# EAGLE design USB-UART_FT230XS_double-sided (EAGLE 7.4.0)
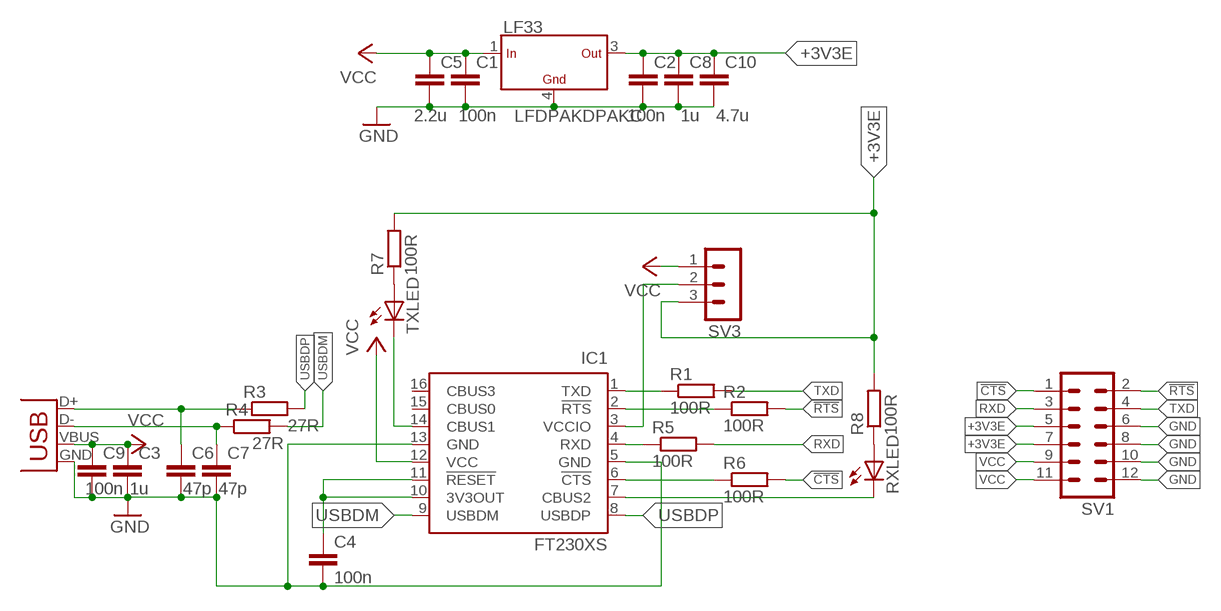
[diagram p0: schematic, sheet 1]

## Parts
C1  100n  C-EUC0805  [C0805]
C2  100n  C-EUC0805  [C0805]
C3  1u  C-EUC0805  [C0805]
C4  100n  C-EUC0805  [C0805]
C5  2.2u  C-EUC1206  [C1206]
C6  47p  C-EUC0805  [C0805]
C7  47p  C-EUC0805  [C0805]
C8  1u  C-EUC1206  [C1206]
C9  100n  C-EUC1206  [C1206]
C10  4.7u  C-EUC1206  [C1206]
IC1  FT230XS  [SSOP16]
LF33  LFDPAKDPAKC  [DPAK]
R1  100R  R-EU_M0805  [M0805]
R2  100R  R-EU_M0805  [M0805]
R3  27R  R-EU_M0805  [M0805]
R4  27R  R-EU_M0805  [M0805]
R5  100R  R-EU_M0805  [M0805]
R6  100R  R-EU_M0805  [M0805]
R7  100R  R-EU_M0805  [M0805]
R8  100R  R-EU_M0805  [M0805]
RXLED  LEDCHIP-LED0603  [CHIP-LED0603]
SV1  MA06-2  [MA06-2]
SV3  MA03-1  [MA03-1]
TXLED  LEDCHIP-LED0603  [CHIP-LED0603]
X1  USBSMD  [USB-MINIB]

## Nets
!CTS: R6.2 SV1.1
!RTS: R2.2 SV1.2
+3V3E: C2.1 C8.1 C10.1 LF33.3(OUT) R7.2 R8.2 SV1.5 SV1.7 SV3.3
GND: C1.2 C2.2 C3.2 C4.2 C5.2 C6.2 C7.2 C8.2 C9.2 C10.2 IC1.5(GND) IC1.13(GND) LF33.4(GND) SV1.6 SV1.8 SV1.10 SV1.12 X1.GND
N$1: C6.1 R3.1 X1.D+
N$2: C7.1 R4.1 X1.D-
N$3: IC1.1(TXD) R1.1
N$4: IC1.2(!RTS) R2.1
N$5: IC1.4(RXD) R5.1
N$6: R7.1 TXLED.A
N$7: IC1.3(VCCIO) SV3.2
N$8: R8.1 RXLED.A
N$9: IC1.14(CBUS1) TXLED.C
N$11: IC1.6(!CTS) R6.1
N$12: C4.1 IC1.10(3V3OUT) IC1.11(!RESET)
RXD: R5.2 SV1.3
RXLED: IC1.7(CBUS2) RXLED.C
TXD: R1.2 SV1.4
USBDM: IC1.9(USBDM) R4.2
USBDP: IC1.8(USBDP) R3.2
VCC: C1.1 C3.1 C5.1 C9.1 IC1.12(VCC) LF33.1(IN) SV1.9 SV1.11 SV3.1 X1.VBUS
Unconnected: IC1.15(CBUS0) IC1.16(CBUS3)

## Library data of the parts
C1-C10 = rcl:C-EU: CAPACITOR, European symbol
IC1 = ftdichip:FT230X: USB to BASIC UART IC Auto generated by make-symbol-device-package-bsdl.ulp Rev. 43 Source: Data sheet <http://www.ftdichip.com/Support/Documents/DataSheets/ICs/DS_FT230X.pdf>
LF33 = #PaJa_30:LF??C: LF??C - stabilizátory low-drop výstup dle typu 1,25 - 12V
R1-R8 = rcl:R-EU_: RESISTOR, European symbol
RXLED TXLED = led:LED: LED OSRAM: - CHIPLED LG R971, LG N971, LY N971, LG Q971, LY Q971, LO R971, LY R971 LH N974, LH R974 LS Q976, LO Q976, LY Q976 LO Q996 - Hyper CHIPLED LW Q18S LB Q993, LB Q99A, LB R99A - SideLED LS A670, LO A670, LY A670, LG A670, LP A670 LB A673, LV A673, LT A673, LW A673 LH A674 LY A675 LS A676, LA A676, LO A676, LY A676, LW A676 LS A679, LY A679, LG A679 - Hyper Micro SIDELED® LS Y876, LA Y876, LO Y876, LY Y876 LT Y87S - SmartLED LW L88C, LW L88S LB L89C, LB L89S, LG L890 LS L89K, LO L89K, LY L89K LS L896, LA L896, LO L896, LY L896 - TOPLED LS T670, LO T670, LY T670, LG T670, LP T670 LSG T670, LSP T670, LSY T670, LOP T670, LYG T670 LG T671, LOG T671, LSG T671 LB T673, LV T673, LT T673, LW T673 LH T674 LS T676, LA T676, LO T676, LY T676, LB T676, LH T676, LSB T676, LW T676 LB T67C, LV T67C, LT T67C, LS T67K, LO T67K, LY T67K, LW E67C LS E67B, LA E67B, LO E67B, LY E67B, LB E67C, LV E67C, LT E67C LW T67C LS T679, LY T679, LG T679 LS T770, LO T770, LY T770, LG T770, LP T770 LB T773, LV T773, LT T773, LW T773 LH T774 LS E675, LA E675, LY E675, LS T675 LS T776, LA T776, LO T776, LY T776, LB T776 LHGB T686 LT T68C, LB T68C - Hyper Mini TOPLED® LB M676 - Mini TOPLED Santana® LG M470 LS M47K, LO M47K, LY M47K Source: http://www.osram.convergy.de LUXEON: - LUMILED® LXK2-PW12-R00, LXK2-PW12-S00, LXK2-PW14-U00, LXK2-PW14-V00 LXK2-PM12-R00, LXK2-PM12-S00, LXK2-PM14-U00 LXK2-PE12-Q00, LXK2-PE12-R00, LXK2-PE12-S00, LXK2-PE14-T00, LXK2-PE14-U00 LXK2-PB12-K00, LXK2-PB12-L00, LXK2-PB12-M00, LXK2-PB14-N00, LXK2-PB14-P00, LXK2-PB14-Q00 LXK2-PR12-L00, LXK2-PR12-M00, LXK2-PR14-Q00, LXK2-PR14-R00 LXK2-PD12-Q00, LXK2-PD12-R00, LXK2-PD12-S00 LXK2-PH12-R00, LXK2-PH12-S00 LXK2-PL12-P00, LXK2-PL12-Q00, LXK2-PL12-R00 Source: www.luxeon.com KINGBRIGHT: KA-3528ASYC Source: www.kingbright.com
SV1 = con-lstb:MA06-2: PIN HEADER; OC_FARNELL: unknown; OC_NEWARK: unknown
SV3 = con-lstb:MA03-1: PIN HEADER; OC_FARNELL: unknown; OC_NEWARK: unknown
X1 = SparkFun:USB: USB Connectors USB-B-PTH is fully proven SKU : PRT-00139 USB-miniB is fully proven SKU : PRT-00587 USB-A-PCB is untested. USB-A-H is throughly reviewed, but untested. Spark Fun Electronics SKU : PRT-00437 USB-B-SMT is throughly reviewed, but untested. Needs silkscreen touching up. USB-A-S has not been used/tested USB-MB-H has not been used/tested

## Board
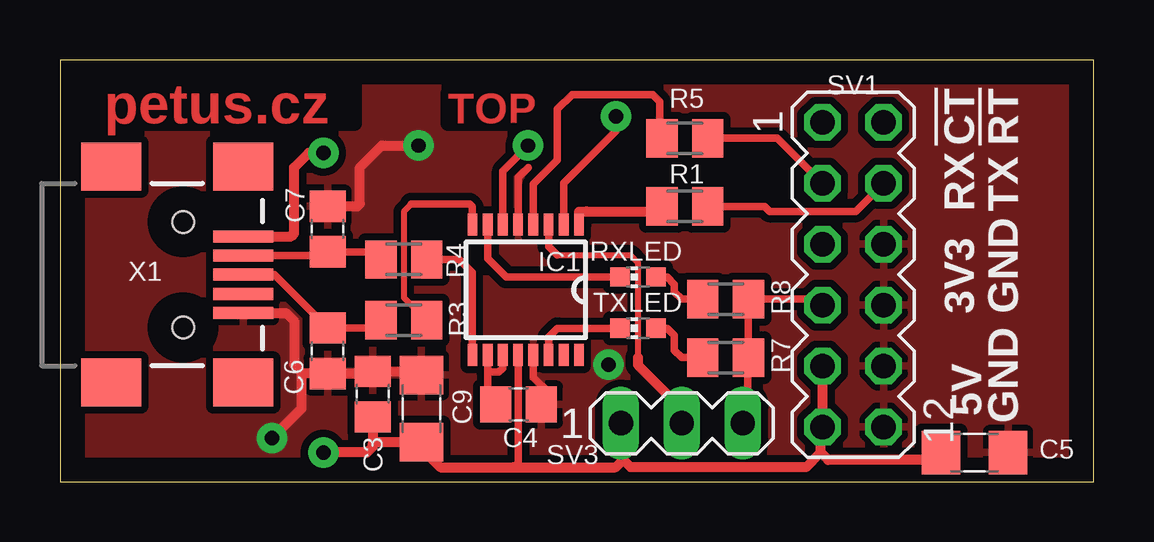
[diagram p1: board, top side]
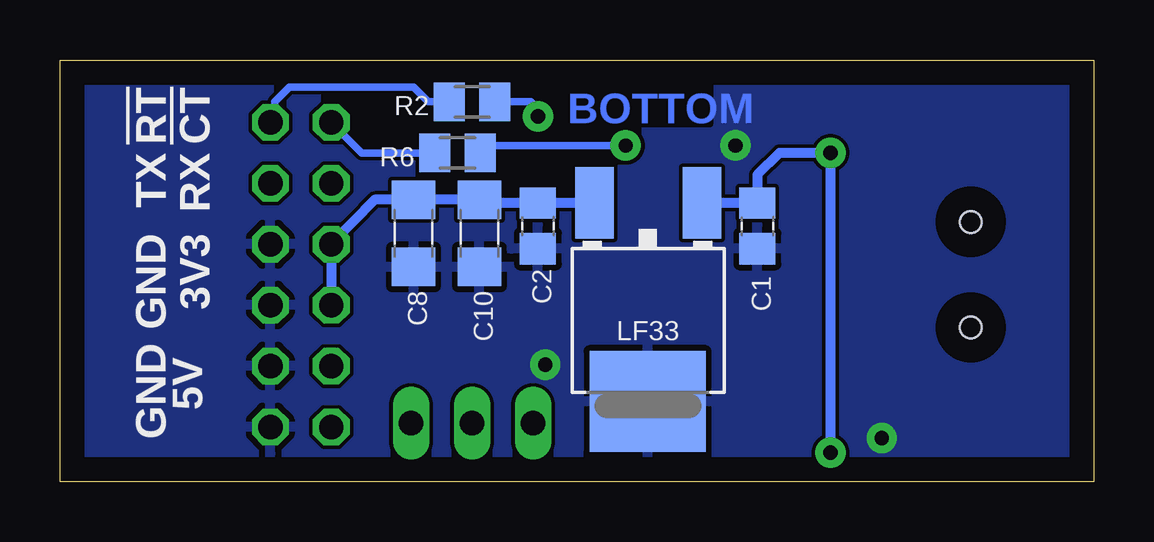
[diagram p2: board, bottom side, seen from below]

Size 43.08 x 17.59 mm. Coordinates in mm from the lower left corner, seen from the top.
Outline: 0,0 43.08,0 43.08,17.59 0,17.59 0,0
Copper layers (1*16): Top 0.035mm / dielectric 1.5mm / Bottom 0.035mm
Design rules "default *": minimum track width 10mil, minimum drill 24mil, track to track 6mil, track to pad 6mil, pad to pad 6mil, via to via 6mil, smd to smd 6mil, copper to edge 40mil, drill to drill 6mil, minimum pad ring 10mil, minimum via ring 8mil, stop-mask expansion 4mil, vias tented up to drill 0mil, thermal gap 10mil

### Footprints (pad centres in the part's own frame; a part is rotated, then mirrored left to right if it is on the bottom)
C0805 = smd 1.3 x 1.5: 1 -0.95,0; 2 0.95,0
C1206 = smd 1.6 x 1.8: 1 -1.4,0; 2 1.4,0
SSOP16 = smd 0.914 x 0.406: 1 -2.718,2.223; 2 -2.718,1.587; 3 -2.718,0.953; 4 -2.718,0.318; 5 -2.718,-0.318; 6 -2.718,-0.953; 7 -2.718,-1.587; 8 -2.718,-2.223; 9 2.718,-2.223; 10 2.718,-1.587; 11 2.718,-0.953; 12 2.718,-0.318; 13 2.718,0.318; 14 2.718,0.953; 15 2.718,1.587; 16 2.718,2.223
DPAK = smd 1.6 x 2.997: 1 -2.261,-4.928; 3 2.21,-4.928 | smd 4.826 x 4.191: 4 0,3.353
M0805 = smd 1.3 x 1.6: 1 -0.95,0; 2 0.95,0
CHIP-LED0603 = smd 0.8 x 0.8: A 0,-0.75; C 0,0.75
MA06-2 = drill 1.016 octagon: 1 -6.35,-1.27; 2 -6.35,1.27; 3 -3.81,-1.27; 4 -3.81,1.27; 5 -1.27,-1.27; 6 -1.27,1.27; 7 1.27,-1.27; 8 1.27,1.27; 9 3.81,-1.27; 10 3.81,1.27; 11 6.35,-1.27; 12 6.35,1.27
MA03-1 = drill 1.016 long: 1 -2.54,0; 2 0,0; 3 2.54,0
USB-MINIB = smd 2.5 x 0.5: D+ 2.5,0; D- 2.5,0.8; GND 2.5,-1.6; ID 2.5,-0.8; VBUS 2.5,1.6 | smd 2.5 x 2: MTN1 -3,4.5; MTN2 2.5,4.5; MTN3 -3,-4.5; MTN4 2.5,-4.5 | hole 0.9: 0,2.2; 0,-2.2

### Placement (x,y rotation side)
C1  14.02,10.67 270 bottom
C2  23.16,10.67 270 bottom
C3  13.03,3.66 90 top
C4  19.1,3.23 0 top
C5  38.1,1.22 0 top
C6  11.15,5.46 270 top
C7  11.15,10.54 90 top
C8  28.35,10.36 270 bottom
C9  15.06,3.05 90 top
C10  25.6,10.36 270 bottom
IC1  19.41,8 270 top
LF33  LFDPAK?C  [DPAK]  18.59,6.71 180 bottom
R1  26.04,11.48 0 top
R2  25.91,15.85 180 bottom
R3  14.33,6.73 0 top
R4  14.33,9.27 0 top
R5  26.04,14.33 0 top
R6  26.52,13.72 180 bottom
R7  27.74,5.18 0 top
R8  27.74,7.62 0 top
RXLED  24.08,8.53 90 top
SV1  33.05,8.64 270 top
SV3  25.91,2.44 0 top
TXLED  24.08,6.4 90 top
X1  5.13,8.64 0 top

### Tracks (layer width: path | path; a pad name or v marks a point on that pad's centre or on a via)
!CTS
  Bottom 0.305: R6.2 30.5,13.72 SV1.1
!RTS
  Bottom 0.305: R2.2 27.74,15.85 28.35,16.46 33.53,16.46 34.14,15.85 34.14,15.16 SV1.2
+3V3E
  Top 0.305: SV3.3 28.65,2.74 28.65,5.15 R7.2 R8.2 31.52,7.62 SV1.7
  Bottom 0.406: LF33.3 23.15,11.63 C2.1 25.46,11.62 C10.1 C8.1 29.97,11.76 SV1.5 SV1.7
GND  (via drill 0.6 pad 1.27)
  Top 0.305: IC1.5 19.09,12.69 19.51,13.11 | IC1.13 19.72,4.36 20.42,3.66 20.42,3.31 C4.2
  Top 0.406: C6.2 12.93,4.51 C3.2 14.9,4.61 C9.2 | X1.GND 9.42,7.04 9.75,6.71 9.75,4.88 10.06,4.57 | 11.09,4.57 C6.2 | C7.2 12.4,11.49 12.5,11.58 12.5,13.11 13.41,14.02 v14.94,14.02 | 10.06,4.57 10.06,3.05 v8.84,1.83 | C6.2 10.12,4.51 10.06,4.57
  other vias: 22.86,4.88
  pour Top (isolate 0.305): 0,17.6 43.1,17.6 43.1,0 0,0
  pour Bottom: 0,17.68 42.98,17.68 42.98,0 0,0
N$1
  Top 0.305: R3.1 13.06,6.41 C6.1 8.93,8.64 X1.D+
N$2
  Top 0.305: X1.D- 11,9.44 C7.1 13.06,9.59 R4.1
N$3
  Top 0.406: IC1.1 21.63,11.27 21.95,11.28 24.98,11.28 R1.1
N$4  (via drill 0.6 pad 1.27)
  Top 0.305: IC1.2 20.99,12.46 23.16,14.63 v23.16,15.24
  Bottom 0.305: v23.16,15.24 23.16,15.54 23.47,15.85 R2.1
N$5
  Top 0.305: IC1.4 19.72,12.41 20.73,13.41 20.73,15.54 21.34,16.15 24.69,16.15 24.99,15.85 24.99,14.42 R5.1
N$6
  Top 0.305: TXLED.A 25.3,6.4 25.6,6.1 25.6,5.49 25.91,5.18 R7.1
N$7
  Top 0.254: 20.73,9.45 23.77,9.45 24.08,9.14 24.08,5.18
  Top 0.305: IC1.3 20.36,9.82 20.73,9.45
  Top 0.406: 24.08,5.18 24.08,4.88 25.91,3.05 SV3.2
N$8
  Top 0.305: RXLED.A 25.3,8.53 25.6,8.23 25.6,7.92 25.91,7.62 R8.1
N$9
  Top 0.305: IC1.14 20.36,6.03 20.73,6.4 TXLED.C
N$11  (via drill 0.6 pad 1.27)
  Top 0.305: IC1.6 18.45,12.97 v19.51,14.02
  Bottom 0.305: v19.51,14.02 25.26,14.02 R6.1
N$12
  Top 0.305: IC1.10 17.82,4.57 | 17.82,4.57 17.82,3.53 C4.1 | IC1.11 18.45,4.74 18.29,4.57 17.82,4.57
RXD
  Top 0.305: R5.2 29.9,14.33 SV1.3
RXLED
  Top 0.305: IC1.7 17.82,9.31 18.59,8.53 RXLED.C
TXD
  Top 0.305: R1.2 29.36,11.48 29.57,11.28 33.15,11.28 SV1.4
USBDM
  Top 0.305: R4.2 16.64,9.27 17.18,8.72 IC1.9
USBDP
  Top 0.254: 14.63,11.58 14.33,11.28 14.33,7.68 R3.2
  Top 0.305: IC1.8 17.18,11.47 17.07,11.58 14.63,11.58
VCC  (via drill 0.6 pad 1.27)
  Top 0.305: IC1.12 19.09,0.8 18.9,0.61
  Top 0.406: SV1.9 SV1.11 31.7,2.21 31.7,1.22 | X1.VBUS 9.63,10.24 9.75,10.36 9.75,13.11 10.36,13.72 v10.97,13.72 | 23.47,0.91 23.16,0.61 18.9,0.61 15.85,0.61 15.06,1.4 C9.1 13.15,1.65 13.03,1.52 | 23.47,0.91 23.47,2.34 SV3.1 | 23.47,0.91 23.77,0.61 31.09,0.61 31.7,1.22 | C3.1 13.03,1.52 | 13.03,1.52 13.03,1.45 12.8,1.22 v10.97,1.22 | C5.1 36.27,0.91 32,0.91 31.7,1.22
  Bottom 0.406: LF33.1 16.32,11.62 C1.1 14.02,12.8 13.11,13.72 v10.97,13.72 v10.97,1.22

### Text on the board
Top: petus.cz | TOP
Bottom: BOTTOM
tNames: !CT | !RT | RX | TX | 3V3 | GND | 5V | GND
bNames: !CT | !RT | RX | TX | 3V3 | GND | GND | 5V